# EAGLE design EFD01 - C. Feeder (EAGLE 7.4.0)
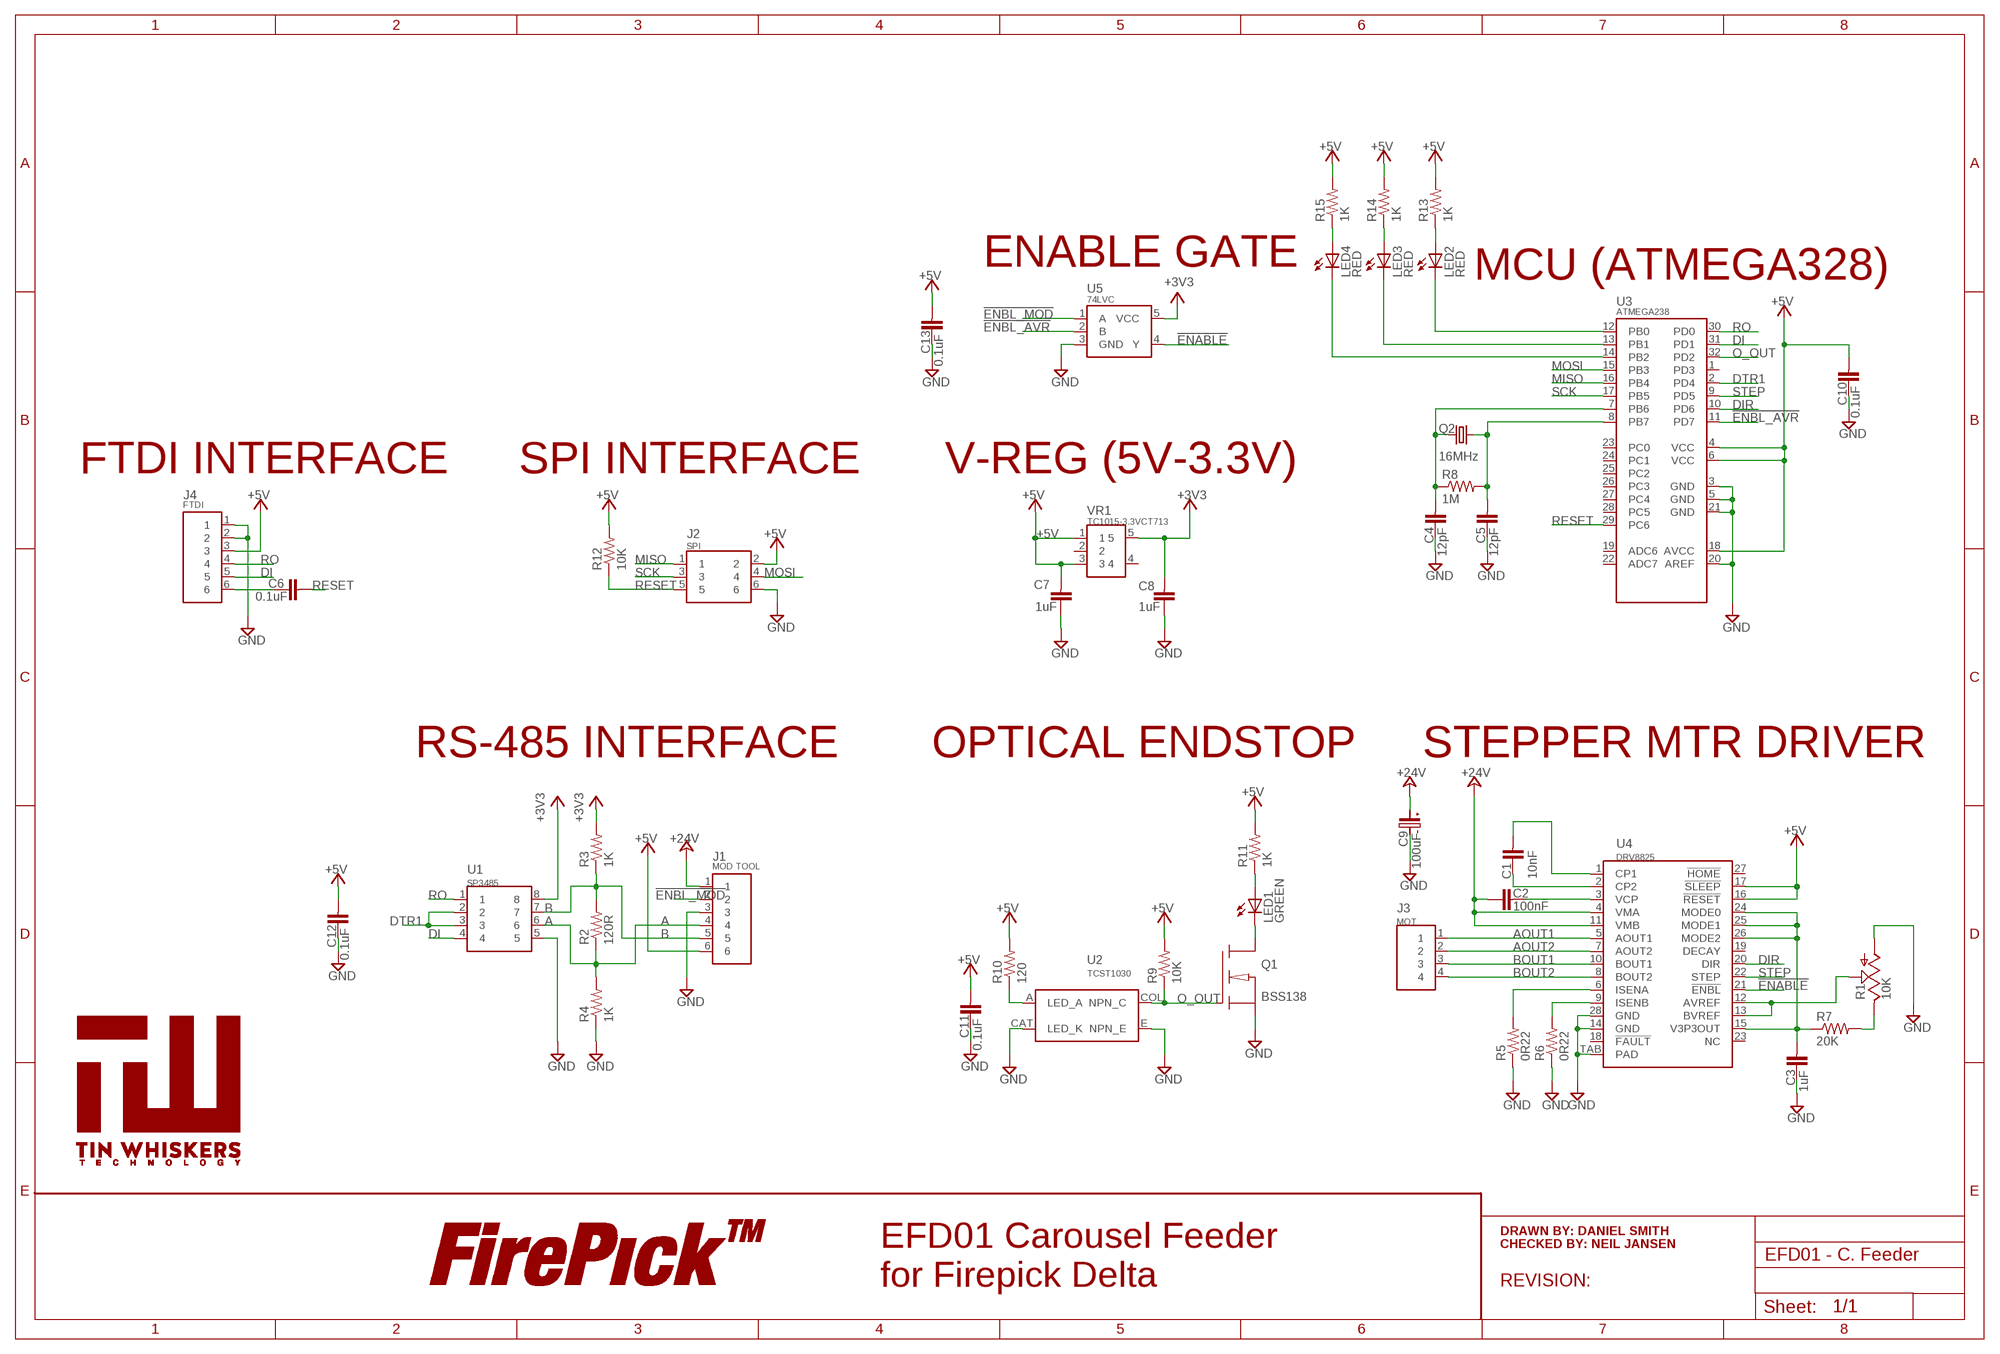
[diagram p0: schematic, sheet 1]

## Parts
C1  10nF  CPL-CAP-X7R-0603-10NF-50V  [C0603]
C2  100nF  CPL-CAP-X7R-0603-100NF-50V  [C0603]
C3  1uF  CPL-CAP-X5R-0603-1UF-50V  [C0603]
C4  12pF  CPL-CAP-C0G-0603-12PF-50V  [C0603]
C5  12pF  CPL-CAP-C0G-0603-12PF-50V  [C0603]
C6  0.1uF  CPL-CAP-X7R-0603-100NF-50V  [C0603]
C7  1uF  CPL-CAP-X5R-0603-1UF-50V  [C0603]
C8  1uF  CPL-CAP-X5R-0603-1UF-50V  [C0603]
C9  100uF  CPL-CAP-ALU-SMD-100UF-50V  [C-SMD-6.3MM]
C10  0.1uF  CPL-CAP-X7R-0603-0.1UF-35V  [C0603]
C11  0.1uF  CPL-CAP-X7R-0603-0.1UF-35V  [C0603]
C12  0.1uF  CPL-CAP-X7R-0603-0.1UF-35V  [C0603]
C13  0.1uF  CPL-CAP-X7R-0603-0.1UF-35V  [C0603]
J1  MOD TOOL  CPL-CON-JST-2.0MM-6P-M-RA  [CONN-JST-PH-2.0MM-6P-SMT-RA]
J2  SPI  CPL-CON-HEADER-0.1IN-2X3P-M  [CON-HDR-2X3P]
J3  MOT  CPL-CON-JST-2.0MM-4P-M-RA  [CONN-JST-PH-2.0MM-4P-SMT-RA]
J4  FTDI  CPL-CON-HEADER-0.1IN-6P-M  [CON-HDR-6POS-MALE]
LED1  GREEN  CPL-LED-0603-GREEN  [LED0603]
LED2  RED  CPL-LED-0603-RED  [LED0603]
LED3  RED  CPL-LED-0603-RED  [LED0603]
LED4  RED  CPL-LED-0603-RED  [LED0603]
LOGO2  LOGO-FIREPICKLARGE  [LOGO-FIREPICK]
Q1  BSS138  CPL-TRN-NFET-SOT23  [SOT-23-3]
Q2  16MHz  CPL-OSC-CRY-16MHZ-18PF  [HC-49/U-S]
R1  10K  TC33X-2  [TC33X-2]
R2  120R  CPL-RES-0603-120-0.1W  [R0603]
R3  1K  CPL-RES-0603-1K-0.1W  [R0603]
R4  1K  CPL-RES-0603-1K-0.1W  [R0603]
R5  0R22  CPL-RES-1206-0.22-0.5W  [R1206]
R6  0R22  CPL-RES-1206-0.22-0.5W  [R1206]
R7  20K  CPL-RES-0603-20K-0.1W  [R0603]
R8  1M  CPL-RES-0603-1M-0.1W  [R0603]
R9  10K  CPL-RES-0603-10K-0.1W  [R0603]
R10  120  CPL-RES-0603-120-0.1W  [R0603]
R11  1K  CPL-RES-0603-1K-0.1W  [R0603]
R12  10K  CPL-RES-0603-10K-0.1W  [R0603]
R13  1K  CPL-RES-0603-1K-0.1W  [R0603]
R14  1K  CPL-RES-0603-1K-0.1W  [R0603]
R15  1K  CPL-RES-0603-1K-0.1W  [R0603]
U1  SP3485  [SOICN-8]
U2  TCST1030  TCSTXX30  [TCST1030]
U3  ATMEGA238  CPL-MCU-ATMEL-AT328-32TQFP  [32-TQF(ATMEGA)]
U4  DRV8825  CPL-MDR-DRV8825  [28-HSSOP]
U5  74LVC  CPL-IC-LOGIC-OR-1CH-74LVC  [SOT-23-5]
U$1  TIN-WHISKERSSMALL  [TIN-WHISKERS-SMALL]
VR1  TC1015-3.3VCT713  CPL-REG-LIN-3.3V-0.1A  [SOT-23-5]

## Nets
!ENABLE: U4.21(!ENBL) U5.4(Y)
!ENBL_AVR: U3.11(PD7) U5.2(B)
!ENBL_MOD: J1.2 U5.1(A)
+3V3: C8.2 R3.2 U1.8 U5.5(VCC) VR1.5
+5V: C7.2 C10.2 C11.2 C12.2 C13.2 J1.6 J2.2 J4.3 R9.2 R10.2 R11.2 R12.2 R13.2 R14.2 R15.2 U3.4(VCC) U3.6(VCC) U3.18(AVCC) U4.16(!RESET) U4.17(!SLEEP) VR1.1 VR1.3
+24V: C2.1 C9.POS J1.1 U4.4(VMA) U4.11(VMB)
A: J1.4 R2.1 R4.2 U1.6
AOUT1: J3.1 U4.5(AOUT1)
AOUT2: J3.2 U4.7(AOUT2)
B: J1.5 R2.2 R3.1 U1.7
BOUT1: J3.3 U4.10(BOUT1)
BOUT2: J3.4 U4.8(BOUT2)
DI: J4.5 U1.4 U3.31(PD1)
DIR: U3.10(PD6) U4.20(DIR)
DTR1: U1.2 U1.3 U3.2(PD4)
GND: C3.1 C4.1 C5.1 C7.1 C8.1 C9.NEG C10.1 C11.1 C12.1 C13.1 J1.3 J2.6 J4.1 J4.2 Q1.2(S) R1.1(A) R4.1 R5.1 R6.1 U1.5 U2.CAT(LED_K) U2.E(NPN_E) U3.3(GND) U3.5(GND) U3.20(AREF) U3.21(GND) U4.14(GND) U4.28(GND) U4.TAB(PAD) U5.3(GND)
MISO: J2.1 U3.16(PB4)
MOSI: J2.4 U3.15(PB3)
N$1: LED1.C Q1.3(D)
N$2: R10.1 U2.A(LED_A)
N$3: LED1.A R11.1
N$5: C1.2 U4.1(CP1)
N$6: C1.1 U4.2(CP2)
N$7: LED2.C U3.12(PB0)
N$8: R5.2 U4.6(ISENA)
N$9: R6.2 U4.9(ISENB)
N$10: LED2.A R13.1
N$11: LED3.C U3.13(PB1)
N$12: LED3.A R14.1
N$13: C3.2 R7.1 U4.15(V3P3OUT) U4.24(MODE0) U4.25(MODE1) U4.26(MODE2)
N$14: R1.3(E) R7.2
N$15: R1.2(S) U4.12(AVREF) U4.13(BVREF)
N$16: C6.1 J4.6
N$17: LED4.C U3.14(PB2)
N$18: LED4.A R15.1
O_OUT: Q1.1(G) R9.1 U2.COL(NPN_C) U3.32(PD2)
RESET: C6.2 J2.5 R12.1 U3.29(PC6)
RO: J4.4 U1.1 U3.30(PD0)
SCK: J2.3 U3.17(PB5)
STEP: U3.9(PD5) U4.22(STEP)
VCP: C2.2 U4.3(VCP)
XTAL1: C4.2 Q2.1 R8.1 U3.7(PB6)
XTAL2: C5.2 Q2.2 R8.2 U3.8(PB7)
Unconnected: U3.1(PD3) U3.19(ADC6) U3.22(ADC7) U3.23(PC0) U3.24(PC1) U3.25(PC2) U3.26(PC3) U3.27(PC4) U3.28(PC5) U4.18(!FAULT) U4.19(DECAY) U4.23(NC) U4.27(!HOME) VR1.2 VR1.4

## Notes on the sheet
- ENABLE GATE | MCU (ATMEGA328)
- FTDI INTERFACE | SPI INTERFACE | V-REG (5V-3.3V)
- SPI
- RS-485 INTERFACE | OPTICAL ENDSTOP | STEPPER MTR DRIVER
- DRAWN BY: DANIEL SMITH
- CHECKED BY: NEIL JANSEN
- EFD01 Carousel Feeder
  for Firepick Delta
- REVISION:

## Library data of the parts
C1 = TinWhiskers:CPL-CAP-X7R-0603-10NF-50V: Capacitor: 10nF (0.01uF), X7R, 5%; Package: 0603; Datasheet:; PARTNO: GRM188R71H103KA01D
C2 C6 = TinWhiskers:CPL-CAP-X7R-0603-100NF-50V: Capacitor: 100nF, 50V, 10%; Package: 0603; PARTNO: UMK107B7104KA-T
C3 C7 C8 = TinWhiskers:CPL-CAP-X5R-0603-1UF-50V: Capacitor: 1uF, 50V, 10%; Package: 0603; Datasheet: http://www.mouser.com/ds/2/396/mlcc_all_e-541559.pdf; PARTNO: UMK107AB7105KA-T
C4 C5 = TinWhiskers:CPL-CAP-C0G-0603-12PF-50V: Capacitor: 12pF, 50V, 5%; Package: 0603; Datasheet: http://download.siliconexpert.com/pdfs/2011/4/6/10/1/57/701/samelm_/manual/cl10c120jb8nnnc.pdf; PARTNO: GRM1885C1H120FA01J
C9 = TinWhiskers:CPL-CAP-ALU-SMD-100UF-50V: Capacitor: Al-Electrolytic, 100uF, 20%, 50V, 2000hrs@105C; Package: 6.3MM Diameter (Can); Datasheet: http://industrial.panasonic.com/lecs/www-data/pdf/ABA0000/ABA0000CE135.pdf; PARTNO: EMVA500ADA101MHA0G
C10-C13 = TinWhiskers:CPL-CAP-X7R-0603-0.1UF-35V: Capacitor: 0.1uF, 35V, 10%, X7R; Package: 0603; Datasheet: http://www.yuden.co.jp/productdata/catalog/en/mlcc01_hq_e.pdf; PARTNO: UMK107B7104KA-T
J1 = TinWhiskers:CPL-CON-JST-2.0MM-6P-M-RA: Connector: 2.0mm Pitch, 6-POS, Pins, Shrouded; Package: PH-Series (SMT, R/A); Datasheet: http://www.jst-mfg.com/product/pdf/eng/ePH.pdf; PARTNO: S6B-PH-SM4-TB(LF)(SN)
J2 = TinWhiskers:CPL-CON-HEADER-0.1IN-2X3P-M: Connector: 0.1" Pitch, 2x3P Datasheet: http://www.mouser.com/ds/2/418/NG_CD_825440_G_baseFilename-672958.pdf; PARTNO: 67996-206HLF
J3 = TinWhiskers:CPL-CON-JST-2.0MM-4P-M-RA: Connector: 2.0mm Pitch, 4-POS, Pin, Shrouded; Package: PH-Series (SMT, R/A); Datasheet: http://www.jst-mfg.com/product/pdf/eng/ePH.pdf; PARTNO: S4B-PH-SM4-TB(LF)(SN)
J4 = TinWhiskers:CPL-CON-HEADER-0.1IN-6P-M: Connector: Header, 0.1"-Pitch, 6-Pos, Pins (Male); PARTNO: S6B-PH-SM4-TB(LF)(SN)
LED1 = TinWhiskers:CPL-LED-0603-GREEN: LED: Green; Package: 0603; PARTNO: SML-D12M8WT86
LED2-LED4 = TinWhiskers:CPL-LED-0603-RED: LED: Red; Package: 0603; PARTNO: SML-D12M8WT86
LOGO2 = FirePick:LOGO-FIREPICK; BOM: EXCLUDE; DNP: T
Q1 = TinWhiskers:CPL-TRN-NFET-SOT23: MOSFET: N-channel ~200mA; Package: SOT23-3 (SMT); Datasheet: http://www.mouser.com/ds/2/149/BSS138-39381.pdf; PARTNO: BSS138
Q2 = TinWhiskers:CPL-OSC-CRY-16MHZ-18PF: Crystal Oscillator: 16MHz, 18pF, 50 Ohm (ESR); Package: HC-49/US; Datasheet: http://cfm.citizen.co.jp/english/product/pdf/HCM49.pdf; PARTNO: HCM4916000000ABJT
R1 = TinWhiskers:TC33X-2: Potentiometer, Trim: 10 kOhm, 25%; Package: SMT (3-Pin); Datasheet: http://www.mouser.com/ds/2/54/TC33-75480.pdf; PARTNO: TC33X-2-103E
R2 R10 = TinWhiskers:CPL-RES-0603-120-0.1W: Resistor: 120 Ohm, 0.1W, 1%; Package: 0603 (SMT); Datasheet:; PARTNO: RC0603FR-07120RL
R3 R4 R11 R13-R15 = TinWhiskers:CPL-RES-0603-1K-0.1W: Resistor: 1 kOhm, 0.1W, 1%; Package: 0603; Datasheet: http://www.yageo.com/NewPortal/yageodocoutput?fileName=/pdf/R-Chip/PYu-RC_Group_51_RoHS_L_3.pdf; PARTNO: RC0603FR-071KL
R5 R6 = TinWhiskers:CPL-RES-1206-0.22-0.5W: Resistor: 0.22 Ohm, 0.5W, 1%, 100 ppm/C Package: 1206 Datasheet: http://www.mouser.com/ds/2/427/rcwe-244377.pdf; PARTNO: RL1206FR-7W0R22L
R7 = TinWhiskers:CPL-RES-0603-20K-0.1W: Resistor: 20 kOhms, 0.1W, 5%, X7R; Package: 0603;; PARTNO: RC0603FR-0722KL
R8 = TinWhiskers:CPL-RES-0603-1M-0.1W: Resistor: 1MOhm, 0.1W, 5%; Package: 0603; Datasheet: http://www.samsungsem.com/global/support/library/product-catalog/__icsFiles/afieldfile/2015/01/12/CHIP_RESISTOR_150112_1.pdf; PARTNO: RC0603FR-071ML
R9 R12 = TinWhiskers:CPL-RES-0603-10K-0.1W: Resistor: 10kOhm, 0.1W, 1%; Package: 0603; Datasheet: http://www.mouser.com/ds/2/315/AOA0000CE2-37512.pdf; PARTNO: RC0603FR-0710KL
U1 = TinWhiskers:SP3485: Transceiver: RS-485 Chip; Package: SOICN-8; Datasheet: http://www.exar.com/common/content/document.ashx?id=639; PARTNO: SP3485
U2 = TinWhiskers:TCSTXX30: Optical Sensor: Transmissive; Package: Thru-Hole(4-Lead); Datasheet: http://www.farnell.com/datasheets/1809822.pdf; PARTNO: TCST1030
U3 = TinWhiskers:CPL-MCU-ATMEL-AT328-32TQFP: Processor: Atmega AT328; Package: 32-TQFP; Datasheet: http://www.atmel.com/devices/atmega328.aspx; PARTNO: ATMEGA328-AUR
U4 = TinWhiskers:CPL-MDR-DRV8825: Motor Driver: DRV8825 (Texas Instrument); Package: (SMT) 28-HSSOP; Datasheet: http://www.ti.com/lit/ds/symlink/drv8825.pdf; PARTNO: DRV8825PWPR
U5 = TinWhiskers:CPL-IC-LOGIC-OR-1CH-74LVC: Logic Gate: OR, 1-Channel; Package: SOT23-5; Datasheet: http://www.ti.com/lit/ds/symlink/sn74lvc1g32.pdf; PARTNO: SN74LVC1G32DBVR
U$1 = !tin-whiskers-logo:TIN-WHISKERS; PARTNO: *
VR1 = TinWhiskers:CPL-REG-LIN-3.3V-0.1A: Voltage Regulator: Linear, Vmax=6, Vout=3.3V, Io=0.1mA; Package: SOT-23-5 Datasheet: http://www.mouser.com/ds/2/268/21335b-29125.pdf; PARTNO: TC1015-3.3VCT713

## Board
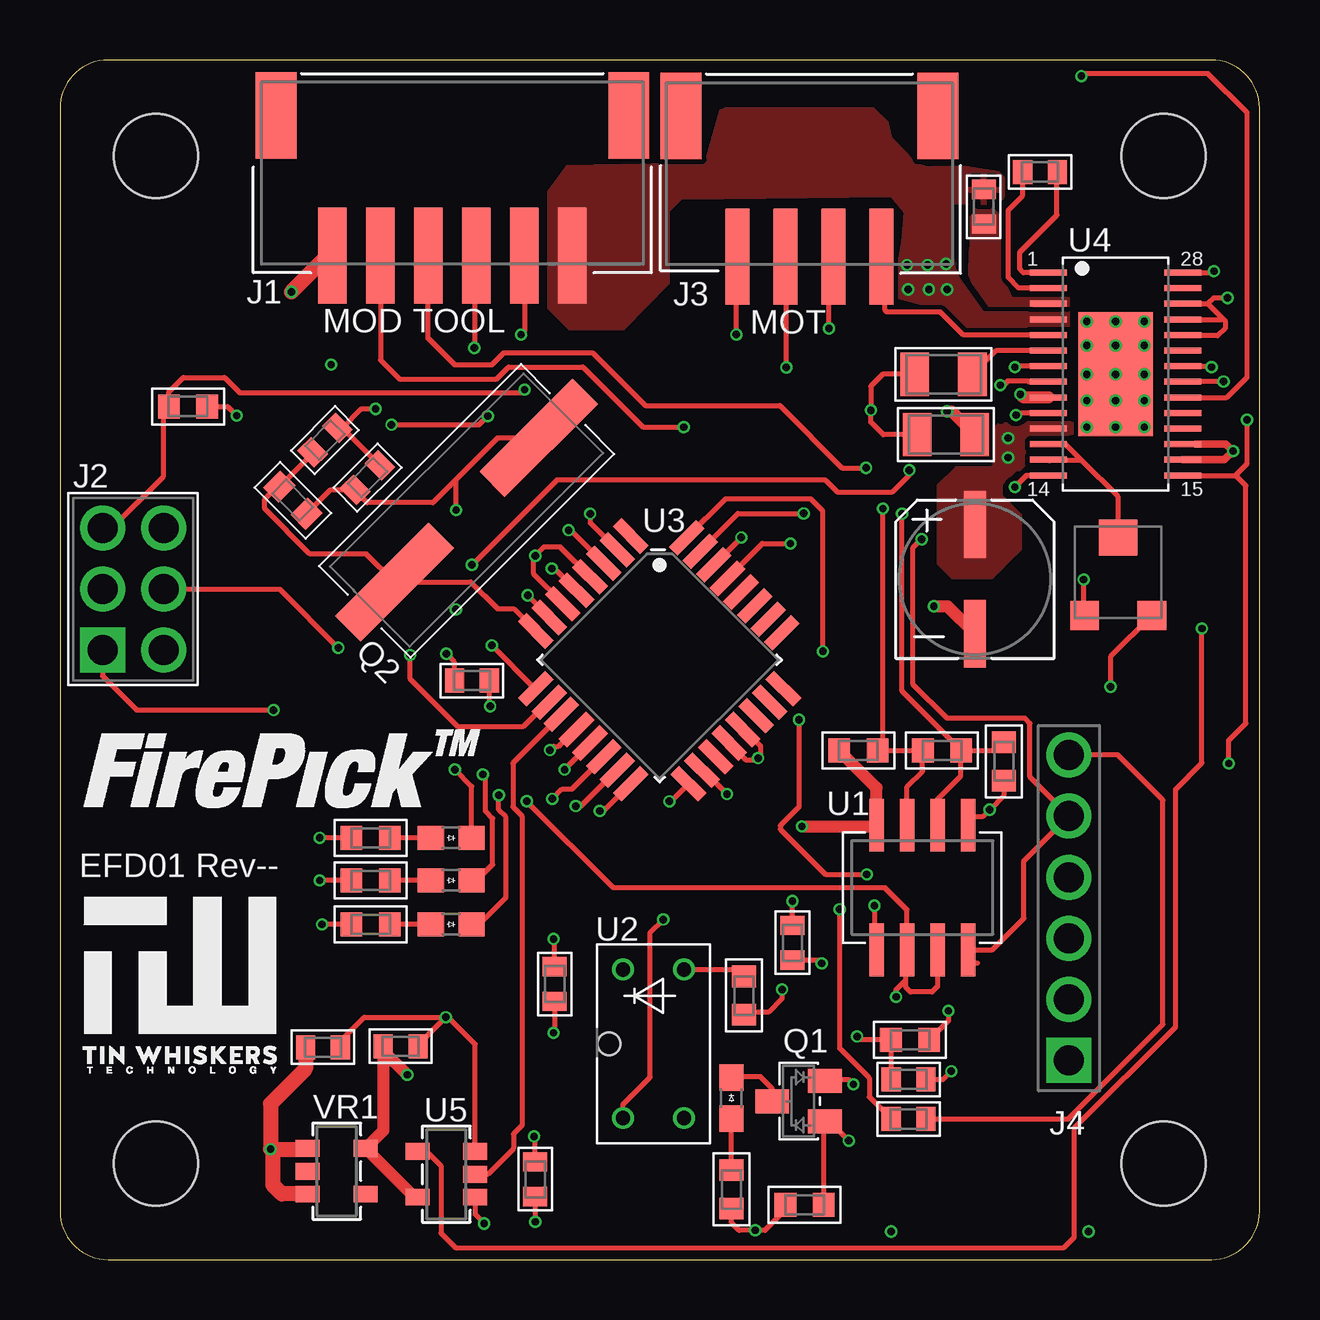
[diagram p1: board, top side]
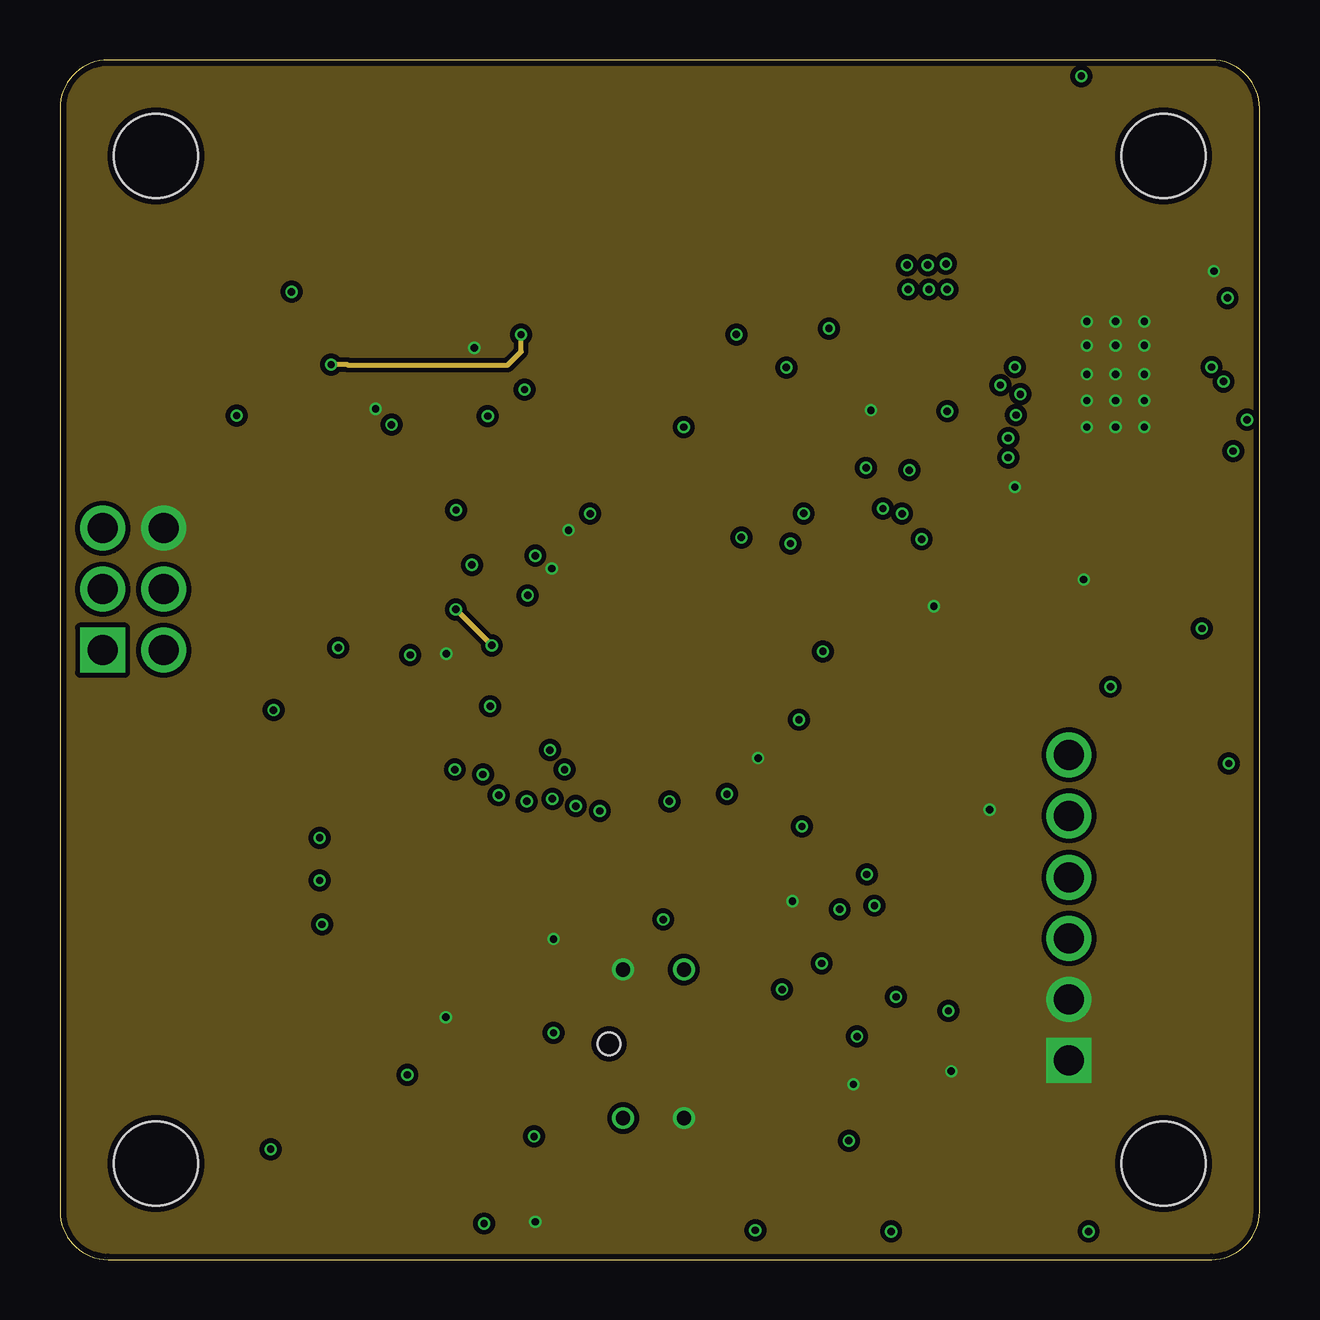
[diagram p2: board, inner layer Route2]
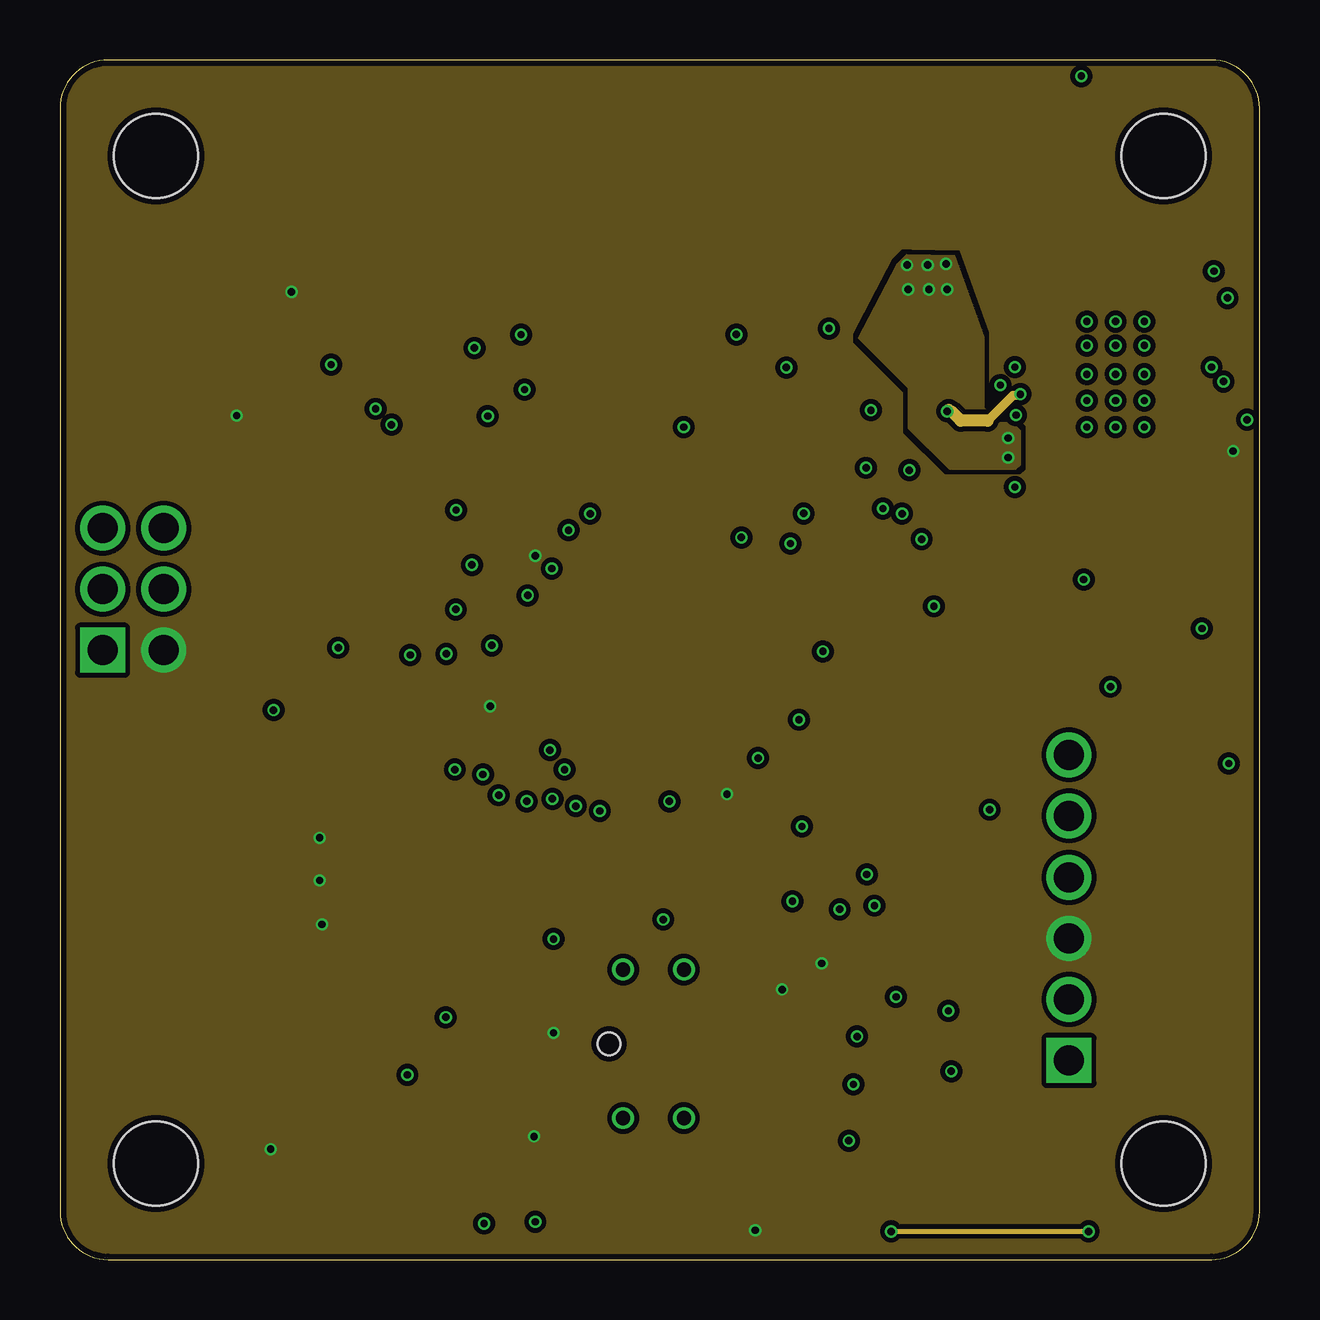
[diagram p3: board, inner layer Route15]
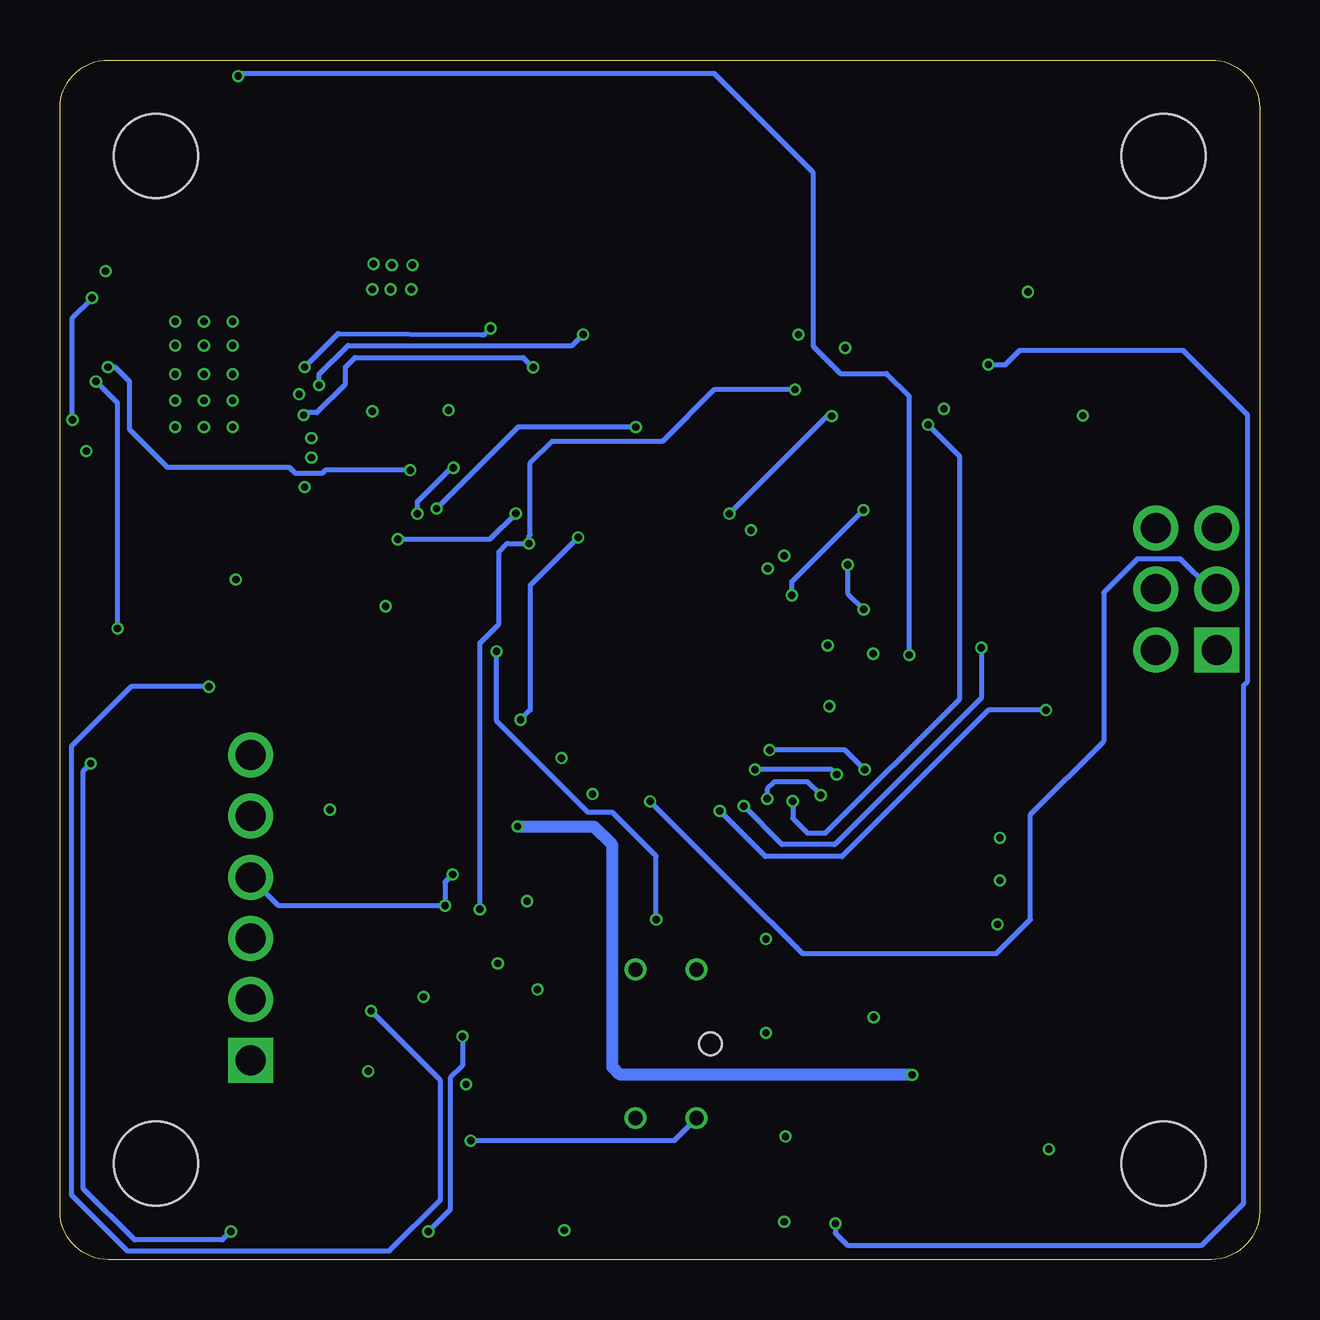
[diagram p4: board, bottom side, seen from below]

Size 50 x 50 mm. Coordinates in mm from the lower left corner, seen from the top.
Outline: 2,0 48,0 arc90 50,2 50,48 arc90 48,50 2,50 arc90 0,48 0,2 arc90 2,0
Copper layers (1*2*15*16): Top 0.035mm / dielectric 0.2mm / Route2 0.0175mm / dielectric 0.3mm / Route15 0.0175mm / dielectric 0.2mm / Bottom 0.035mm
Design rules "HQPCB_4layer_DRU_no_angle": minimum track width 6mil, minimum drill 12mil, track to track 8mil, track to pad 8mil, pad to pad 6mil, via to via 8mil, smd to smd 0mil, copper to edge 10mil, drill to drill 8mil, minimum pad ring 6mil, minimum via ring 4mil, stop-mask expansion 2mil, vias tented up to drill 100mil, thermal gap 10mil
Holes 3.5 mm at 4,4 46,4 46,46 4,46
tKeepout: area 0.8,42.8 to 7.2,49.2; area 42.8,42.8 to 49.2,49.2; area 42.8,0.8 to 49.2,7.2; area 0.8,0.8 to 7.2,7.2
bKeepout: area 0.8,42.8 to 7.2,49.2; area 42.8,42.8 to 49.2,49.2; area 42.8,0.8 to 49.2,7.2; area 0.8,0.8 to 7.2,7.2

### Footprints (pad centres in the part's own frame; a part is rotated, then mirrored left to right if it is on the bottom)
C0603 = smd 0.8 x 1: 1 -0.725,0; 2 0.725,0
C-SMD-6.3MM = smd 0.9 x 2.8: NEG 0,-2.275; POS 0,2.275
CONN-JST-PH-2.0MM-6P-SMT-RA = smd 1.2 x 4: 1 5,0; 2 3,0; 3 1,0; 4 -1,0; 5 -3,0; 6 -5,0 | smd 1.7 x 3.6: NC1 7.35,5.85; NC2 -7.35,5.85
CON-HDR-2X3P = drill 1.25 square: 1 -2.54,1.27 | drill 1.25: 2 -2.54,-1.27; 3 0,1.27; 4 0,-1.27; 5 2.54,1.27; 6 2.54,-1.27
CONN-JST-PH-2.0MM-4P-SMT-RA = smd 1 x 4: 1 3,0; 2 1,0; 3 -1,0; 4 -3,0 | smd 1.7 x 3.6: NC1 5.35,5.85; NC2 -5.35,5.85
CON-HDR-6POS-MALE = drill 1.25 square: 1 -6.35,0 | drill 1.25: 2 -3.8,0; 3 -1.26,0; 4 1.28,0; 5 3.85,0; 6 6.39,0
LED0603 = smd 1.1 x 1: A -0.85,0; C 0.85,0
SOT-23-3 = smd 1 x 1.4: 1 -0.85,-1.1; 2 0.85,-1.1; 3 0,1.1
HC-49/U-S = smd 5.5 x 1.5: 1 -4.25,0; 2 4.25,0
TC33X-2 = smd 1.2 x 1.2: 1 -1.4,-1.8; 3 1.4,-1.8 | smd 1.6 x 1.5: 2 0,1.45
R0603 = smd 0.9 x 1: 1 -0.8,0; 2 0.8,0
R1206 = smd 1.2 x 1.8: 1 -1.2,0; 2 1.2,0
SOICN-8 = smd 2.2 x 0.6: 1 -2.6,1.905; 2 -2.6,0.635; 3 -2.6,-0.635; 4 -2.6,-1.905; 5 2.6,-1.905; 6 2.6,-0.635; 7 2.6,0.635; 8 2.6,1.905
TCST1030 = drill 0.6: A 1.27,3.1; CAT -1.27,3.1; COL -1.27,-3.1; E 1.27,-3.1 | hole 0.95: -1.85,0
32-TQF(ATMEGA) = smd 1.6 x 0.5: 1 -4.5,2.8; 2 -4.5,2; 3 -4.5,1.2; 4 -4.5,0.4; 5 -4.5,-0.4; 6 -4.5,-1.2; 7 -4.5,-2; 8 -4.5,-2.8; 17 4.5,-2.8; 18 4.5,-2; 19 4.5,-1.2; 20 4.5,-0.4; 21 4.5,0.4; 22 4.5,1.2; 23 4.5,2; 24 4.5,2.8 | smd 0.5 x 1.6: 9 -2.8,-4.5; 10 -2,-4.5; 11 -1.3,-4.5; 12 -0.4,-4.5; 13 0.4,-4.5; 14 1.2,-4.5; 15 2,-4.5; 16 2.8,-4.5; 25 2.8,4.4; 26 2,4.4; 27 1.2,4.4; 28 0.4,4.4; 29 -0.4,4.4; 30 -1.2,4.4; 31 -2,4.4; 32 -2.8,4.4
28-HSSOP = smd 1.55 x 0.25: 1 -2.8,4.225; 2 -2.8,3.575; 3 -2.8,2.925; 4 -2.8,2.275; 5 -2.8,1.625; 6 -2.8,0.975; 7 -2.8,0.325; 8 -2.8,-0.325; 9 -2.8,-0.975; 10 -2.8,-1.625; 11 -2.8,-2.275; 12 -2.8,-2.925; 13 -2.8,-3.575; 14 -2.8,-4.225; 15 2.8,-4.225; 16 2.8,-3.575; 17 2.8,-2.925; 18 2.8,-2.275; 19 2.8,-1.625; 20 2.8,-0.975; 21 2.8,-0.325; 22 2.8,0.325; 23 2.8,0.975; 24 2.8,1.625; 25 2.8,2.275; 26 2.8,2.925; 27 2.8,3.575; 28 2.8,4.225 | smd 3.1 x 5.18: TAB 0,0
SOT-23-5 = smd 0.7 x 1: 1 0.95,1.2; 2 0,1.2; 3 -0.95,1.2; 4 -0.95,-1.2; 5 0.95,-1.2

### Placement (x,y rotation side)
C1  40.85,45.33 0 top
C2  38.5,43.88 270 top
C3  35.37,7.51 180 top
C4  12.81,32.6 225 top
C5  11.04,34.15 225 top
C6  35.37,5.86 180 top
C7  10.96,8.85 180 top
C8  14.2,8.89 180 top
C9  38.13,28.36 0 top
C10  17.17,24.13 0 top
C11  20.62,11.48 270 top
C12  30.53,13.21 270 top
C13  19.81,3.35 90 top
J1  16.36,41.84 0 top
J2  3.05,27.94 90 top
J3  31.24,41.81 0 top
J4  42.06,14.65 90 top
LED1  27.99,6.73 90 top
LED2  16.31,17.58 0 top
LED3  16.31,15.8 0 top
LED4  16.31,13.97 0 top
LOGO2  0.79,17.11 0 top
Q1  30.79,6.6 90 top
Q2  16.95,31.24 225 top
R1  44.11,28.65 0 top
R2  36.77,21.22 180 top
R3  33.28,21.22 180 top
R4  39.34,20.76 90 top
R5  36.83,36.9 0 top
R6  36.92,34.38 0 top
R7  35.44,9.16 0 top
R8  9.71,31.65 135 top
R9  31.04,2.29 180 top
R10  28.51,11 270 top
R11  27.99,2.92 270 top
R12  5.33,35.56 0 top
R13  12.95,17.58 180 top
R14  12.95,15.8 180 top
R15  12.95,13.97 180 top
U1  35.95,15.51 90 top
U2  24.74,8.99 0 top
U3  24.99,24.99 315 top
U4  44,36.91 0 top
U5  16.1,3.56 270 top
U$1  0.5,7.5 0 top
VR1  11.53,3.68 90 top

### Tracks (layer width: path | path; a pad name or v marks a point on that pad's centre or on a via)
!ENABLE  (via drill 0.3)
  Top 0.203: U5.4 15.27,4.51 15.88,3.9 15.88,1.1 16.48,0.5 41.85,0.5 42.27,0.91 42.27,5.47 46.5,9.7 46.5,19.6 47.6,20.7 v47.6,26.3 | v48.5,36.6 47.33,36.6 U4.21
  Bottom 0.203: v47.6,26.3 47.6,35.7 v48.5,36.6
!ENBL_AVR
  Top 0.203: U5.2 17.84,3.56 18.9,4.62 18.9,5.23 19.25,5.59 19.25,18.49 18.88,18.86 18.88,20.7 19.1,20.9 20.89,22.69 U3.11
!ENBL_MOD  (via drill 0.3)
  Top 0.203: U5.1 17.3,1.88 v17.68,1.5 | J1.2 19.36,38.69 v19.22,38.55
  Route2 0.203: v19.22,38.55 19.22,37.84 18.66,37.28 11.99,37.28 11.98,37.3 v11.3,37.3
  Bottom 0.203: v17.68,1.5 17.68,1.1 17.18,0.6 2.4,0.6 0.66,2.34 0.66,23.94 0.5,24.1 0.5,35.2 3.2,37.9 10,37.9 10.6,37.3 v11.3,37.3
+3V3  (via drill 0.3)
  Top 0.203: U5.5 14.76,2.61 | C8.2 13.47,8.71 | 33.98,18.05 U1.8
  Top 0.508: C8.2 13.47,5.38 VR1.5 14.76,2.61 | U1.8 34.04,19.66 R3.2 | 13.47,8.71 v14.48,7.7 | v30.93,18.05 33.98,18.05
  Bottom 0.508: v14.48,7.7 26.65,7.7 26.98,8.03 26.98,17.27 27.75,18.05 v30.93,18.05
+5V  (via drill 0.3)
  Top 0.203: R12.2 6.99,35.56 v7.37,35.18 | U3.6 20.96,27.36 19.75,28.57 19.75,29.27 v19.81,29.34 20.18,29.7 20.85,29.7 U3.4 | R10.2 28.61,10.3 29.53,10.3 30.1,10.88 v30.1,11.26 | 10.3,4.6 VR1.1 | 8.88,4.5 v8.78,4.6 | 47.33,34 U4.17 | U3.18 26.8,20.4 v27.8,19.4 | R9.2 30.24,2.07 29.39,1.22 v28.98,1.22 28.31,1.22 27.99,1.53 R11.2 | J1.6 11.15,41.84 | C10.2 17.89,23.1 v17.93,23.06 | C11.2 20.62,9.5 v20.57,9.45 | C12.2 31.61,12.48 v31.75,12.34 | C13.2 19.81,5.08 v19.76,5.13 | R13.2 v10.82,17.58 | R15.2 v10.92,13.97 | R14.2 v10.82,15.8
  Top 0.305: U4.16 48.53,33.33 v48.9,33.7 48.6,34 47.33,34
  Top 0.635: 10.3,4.6 v8.78,4.6 8.78,6.5 10.24,7.96 C7.2 | VR1.3 9.25,2.73 8.88,3.1 8.88,4.5 | 11.15,41.84 v9.65,40.34
  pour Route15 (rank 2, no thermals): 0,0 50,0 50,50 0,50
+24V  (via drill 0.3)
  Top 0.203: 41.19,39.2 U4.4
  other vias: 39.52,34.24 39.52,33.43 36.17,41.45 35.36,40.44 35.31,41.45 36.22,40.44 36.98,40.44 36.93,41.5
  pour Top (no thermals): 34.91,41.5 34.91,40.07 36.3,39.7 36.8,39.7 37.7,38.8 42.1,38.9 42.1,39.5 38.5,39.5 37.51,40.89 37.32,41.35 37.23,41.95 37.23,45.25 35.61,45.7 35.37,46.05 34.67,46.75 34.52,47.4 33.92,48 27.72,48 27.48,47.92 26.87,45.7 21.11,45.6 20.32,44.51 20.32,39.66 21.22,38.76 23.51,38.76 25.4,40.7 25.4,43.7 25.9,44.2 34.63,44.3 35.17,43.65 35.07,42.4
  pour Top (no thermals): 39.12,34.85 40.18,34.8 40.34,34.95 42.11,34.95 42.21,34.9 42.21,34.39 42.06,34.34 40.39,34.29 40.23,34.14 40.23,33.12 39.98,32.87 39.17,32.87 38.96,33.07 38.96,34.7
  pour Route15 (no thermals): 39.12,34.9 39.67,34.9 40.03,34.54 40.03,33.12 39.83,32.92 37.08,32.92 35.36,34.65 35.36,36.32 33.27,38.4 34.9,41.5 35.31,41.91 37.29,41.86 38.51,38.46 38.51,35.51
  pour Top: 36.37,45.57 37.8,45.57 39.12,45.36 39.37,45.11 39.37,44.3 39.07,43.94 37.34,43.99 35.56,43.54 35.61,45.47
  pour Top (no thermals): 36.58,29.01 37.19,28.4 38.86,28.4 40.08,29.62 40.08,31.04 39.27,31.85 39.27,32.31 40.23,33.27 40.23,33.32 40.23,34.44 39.83,34.85 39.37,34.85 38.91,34.39 38.91,33.12 38.81,33.02 37.34,33.02 36.58,32.26
A  (via drill 0.3)
  Top 0.203: U1.6 36.58,19.18 37.55,20.15 37.55,21.2 R2.1 | R2.1 37.57,21.27 | v33.6,33 32.6,33 30,35.6 24.4,35.6 22.2,37.8 18.5,37.8 18,37.3 16.45,37.3 15.34,38.41 15.34,41.82 J1.4 | R2.1 39,21.22 R4.2 | R2.1 35.1,23.69 v35.1,31.09
  Bottom 0.203: v33.6,33 33.7,33 35.1,31.6 v35.1,31.09
AOUT1
  Top 0.203: U4.5 37.67,38.53 36.7,39.5 34.47,39.5 34.39,39.57 34.39,41.66 J3.1
AOUT2  (via drill 0.3)
  Top 0.203: U4.7 39.83,37.23 v39.8,37.2 | v32.05,38.81 32.05,41.62 J3.2
  Bottom 0.203: v39.8,37.2 38.4,38.6 32.42,38.55 32.32,38.55 v32.05,38.81
B  (via drill 0.3)
  Top 0.203: v26,34.7 24.3,34.7 21.8,37.2 18.7,37.2 18.2,36.7 14.15,36.7 13.36,37.49 J1.5 | U1.7 35.31,19.71 35.95,20.35 35.95,21.2 R2.2 R3.1 34.05,21.25 34.3,21.5 v34.3,31.3
  Bottom 0.203: v26,34.7 30.9,34.7 v34.3,31.3
BOUT1  (via drill 0.3)
  Top 0.203: U4.10 39.93,35.28 v39.85,35.2 | v30.28,37.19 30.28,41.78 J3.3
  Bottom 0.203: v39.85,35.2 39.8,35.2 39.7,35.3 39.3,35.3 38.1,36.5 38.1,37.2 37.7,37.6 30.69,37.6 v30.28,37.19
BOUT2  (via drill 0.3)
  Top 0.203: U4.8 40.38,36.58 40.34,36.63 39.52,36.63 39.35,36.45 v39.2,36.45 | v28.19,38.56 28.19,41.76 J3.4
  Bottom 0.203: v39.2,36.45 39.2,36.9 38,38.1 28.65,38.1 v28.19,38.56
DI  (via drill 0.3)
  Top 0.203: v31,31.1 28.25,31.1 26.69,29.54 U3.31 | 38.25,12.35 37.85,12.35 U1.4 38.87,12.91 40.18,14.22 40.18,16.62 J4.5 40.44,20.12 40.44,22.35 40.23,22.55 36.98,22.55 35.56,23.98 35.56,29.67 v35.92,30.02
  Bottom 0.203: v35.92,30.02 32.08,30.02 v31,31.1
DIR  (via drill 0.3)
  Top 0.203: U3.10 20.33,23.23 19.3,22.2 16.6,22.2 14.6,24.2 v14.6,25.2 | U4.20 48.63,35.93 49.48,36.78 49.48,47.8 47.85,49.43 42.67,49.43 v42.57,49.33
  Bottom 0.203: v14.6,25.2 14.6,35.99 15.54,36.93 17.48,36.93 18.6,38.06 18.6,45.3 22.73,49.43 42.47,49.43 v42.57,49.33
DTR1  (via drill 0.3)
  Top 0.203: U1.3 36.58,11.38 36.35,11.15 35.45,11.15 35.25,11.35 35.25,11.65 | 35.25,11.65 35.25,12.85 U1.2 35.31,14.58 34.39,15.49 23.06,15.49 v19.46,19.1 | U3.2 22.1,30.72 v22.1,31.09 | v34.85,10.95 34.85,11.25 35.25,11.65 | v13.82,34.8 17.48,34.8 v17.83,35.15
  Bottom 0.203: v19.46,19.1 19.46,18.39 18.85,17.78 18.09,17.78 12.5,23.37 12.5,33.48 v13.82,34.8 | v17.83,35.15 18.03,35.15 v22.1,31.09
GND  (via drill 0.3)
  Top 0.203: v33.07,7.3 32.88,7.49 31.93,7.49 Q1.2 | U5.3 17.3,8.98 16.18,10.1 v16.08,10.1 | C7.1 11.69,9.11 12.68,10.1 v16.08,10.1 | C8.1 14.92,8.94 v16.08,10.1 | C3.1 36.81,7.51 v37.15,7.85 | v20.5,28.8 20.62,28.8 U3.5 | v21.2,30.4 21.28,30.4 U3.3 | U3.20 28.6,20.82 29.02,20.82 v29.1,20.9 29.2,21 29.2,21.4 28.51,22.09 U3.21 | U4.28 48.03,41.13 v48.1,41.2 | R5.1 34.3,36.9 33.8,36.4 v33.8,35.4 33.8,34.9 34.31,34.38 R6.1 | U4.14 40.28,32.69 v39.8,32.2 | C4.1 11.77,34.66 | 11.77,34.66 C5.1 11.26,34.66 | 11.77,34.66 12.56,35.46 v13.16,35.46 | J1.3 17.36,39.96 17.27,39.88 v17.27,38 | U1.5 37.85,18.47 38.47,18.47 v38.75,18.75 39.34,19.34 R4.1 | R1.1 42.67,26.88 v42.67,28.35 | C10.1 16.45,24.91 v16.1,25.25 | C11.1 20.62,13.31 v20.57,13.36 | C12.1 v30.53,14.94 | C13.1 v19.81,1.57
  Top 0.406: U4.TAB v44,36.9
  Top 0.508: C9.NEG 36.99,27.23 v36.42,27.23
  other vias: 45.2,36.9 45.2,35.8 44,35.8 42.8,35.8 42.8,36.9 42.8,38.1 44,38.1 45.2,38.1 45.2,39.1 44,39.1 42.8,39.1 42.8,34.7 44,34.7 45.2,34.7
  pour Route2 (no thermals): 0,0 50,0 50,50 0,50
MISO  (via drill 0.3)
  Top 0.203: J2.1 1.78,24.32 3.2,22.9 v8.9,22.9 | v22.5,18.7 22.66,18.7 U3.16
  Bottom 0.203: v8.9,22.9 11.3,22.9 17.4,16.8 20.6,16.8 v22.5,18.7
MOSI  (via drill 0.3)
  Top 0.203: J2.4 9.16,27.94 v11.6,25.5 | v21.5,18.9 21.73,18.9 U3.15
  Bottom 0.203: v11.6,25.5 11.6,23.4 17.7,17.3 19.9,17.3 v21.5,18.9
N$1
  Top 0.203: Q1.3 29.69,7.13 29.2,7.62 28.03,7.62 LED1.C
N$2
  Top 0.203: R10.1 | R10.1 28.21,11.8 | U2.A 28.22,12.09 R10.1
N$3
  Top 0.203: R11.1 LED1.A
N$5
  Top 0.203: U4.1 40.17,41.13 40,41.3 40,41.98 41.55,43.54 41.55,45.31 C1.2
N$6
  Top 0.203: U4.2 41.19,40.5 39.97,40.5 39.52,40.95 39.52,43.74 40.13,44.35 40.13,45.32 C1.1
N$7  (via drill 0.3)
  Top 0.203: LED2.C 17.16,19.72 v16.46,20.42 | v20.42,21.23 20.57,21.39 20.78,21.39 21.48,22.09 U3.12
  Bottom 0.203: v16.46,20.42 17.27,21.23 v20.42,21.23
N$8
  Top 0.203: U4.6 39.01,37.88 R5.2
N$9  (via drill 0.3)
  Top 0.508: U4.9 40.16,35.94 v40.03,36.07 | v36.98,35.36 37.15,35.36 R6.2
  Route15 0.381: v40.03,36.07 39.98,36.02 39.73,36.02 38.67,34.96
  Route15 0.508: 37.03,35.41 v36.98,35.36 37.15,35.36 37.55,34.96 38.67,34.96
N$10
  Top 0.203: LED2.A R13.1
N$11  (via drill 0.3)
  Top 0.203: LED3.C 17.37,15.8 18.03,16.46 18.03,18.39 17.73,18.69 17.73,20.12 v17.63,20.22 | v21.03,20.42 22.09,21.48 U3.13
  Bottom 0.203: v17.63,20.22 17.83,20.42 v21.03,20.42
N$12
  Top 0.203: LED3.A R14.1
N$13  (via drill 0.3)
  Top 0.203: C3.2 34.65,9.15 R7.1 33.36,9.16 v33.22,9.3 | U4.26 47.85,39.84 | 47.85,39.84 48.46,39.22 | 48.46,39.22 48.56,39.12 48.56,38.81 48.26,38.51 46.83,38.51 U4.24 | U4.25 48.43,39.19 48.46,39.22 | v49.48,35 49.48,33.17 48.99,32.69 U4.15 46.82,32.66 49.02,32.66 49.43,32.26 49.43,22.35 48.72,21.64 v48.72,20.68 | v48.67,40.08 48.09,40.08 47.85,39.84
  Route15 0.203: v34.65,1.17 v42.88,1.17
  Bottom 0.203: v33.22,9.3 33.22,8.08 33.73,7.57 33.73,2.08 v34.65,1.17 | v49.48,35 49.48,39.27 v48.67,40.08 | v42.88,1.17 43.23,0.81 46.89,0.81 49.02,2.95 49.02,20.37 v48.72,20.68
N$14  (via drill 0.3)
  Top 0.203: v37.03,10.36 37.03,9.95 R7.2 | R1.3 43.79,25.13 v43.79,23.88
  Bottom 0.203: v43.79,23.88 47.04,23.88 49.53,21.39 49.53,2.69 47.19,0.36 36.27,0.36 34.14,2.49 34.14,7.47 v37.03,10.36
N$15
  Top 0.203: 42.6,33.3 41.24,33.3 U4.13 | U4.12 41.92,33.98 42.6,33.3 | R1.2 44.11,31.79 42.6,33.3
N$16
  Top 0.203: C6.1 42.02,5.86 45.97,9.8 45.97,19.15 44.09,21.04 J4.6
N$17  (via drill 0.3)
  Top 0.203: LED4.C 17.48,13.97 18.59,15.09 18.59,18.44 18.29,18.75 v18.29,19.36 | v20.52,19.2 20.93,19.61 21.34,19.61 22.66,20.93 U3.14
  Bottom 0.203: v18.29,19.36 18.85,19.91 20.22,19.91 20.52,19.61 v20.52,19.2
N$18
  Top 0.203: LED4.A R15.1
O_OUT  (via drill 0.3)
  Top 0.203: R9.1 31.84,5.71 Q1.1 32.08,5.75 v32.88,4.95 | U3.32 27.74,31.7 31.3,31.7 31.8,31.2 v31.8,25.35 | U2.COL 23.47,6.47 24.6,7.6 24.6,13.63 v25.15,14.17
  Bottom 0.203: U2.COL 24.41,4.95 v32.88,4.95 | v25.15,14.17 25.15,16.82 26.98,18.64 27.99,18.64 31.8,22.45 v31.8,25.35
RESET  (via drill 0.3)
  Top 0.203: J2.5 2.16,30.48 4.32,32.64 4.32,35.34 R12.1 4.53,36.16 5.14,36.77 6.86,36.77 7.49,36.13 19.24,36.13 v19.37,36.26 | v32.51,14.61 v32.5,14.6 32.5,8.8 33.73,7.57 33.73,6.77 C6.2 | U3.29 29.28,29.84 v30.45,29.84
  Bottom 0.203: v19.37,36.26 22.73,36.26 24.89,34.1 29.5,34.1 30.4,33.2 30.4,30.2 30.45,30.14 30.45,29.85 v30.45,29.84 31.36,29.84 31.7,29.5 31.7,26.5 32.5,25.7 v32.5,14.6
RO  (via drill 0.3)
  Top 0.203: 33.95,12.82 U1.1 33.95,13 v33.95,14.75 | U3.30 v28.4,30.1 | v30.8,22.5 30.8,18.86 30.02,18.09 30.02,17.93 31.9,16.05 v33.63,16.05
  Bottom 0.203: v28.4,30.1 30.4,28.1 30.4,22.9 v30.8,22.5 | J4.4 40.88,14.75 v33.95,14.75 33.95,15.73 v33.63,16.05
SCK  (via drill 0.3)
  Top 0.203: v25.4,19.1 25.46,19.1 U3.17
  Bottom 0.203: J2.3 2.04,27.94 3.3,29.2 5.1,29.2 6.5,27.8 6.5,21.6 9.55,18.55 9.55,14.17 10.97,12.75 19.05,12.75 21.8,15.5 v25.4,19.1
STEP  (via drill 0.3)
  Top 0.203: U3.9 19.81,23.79 v18,25.6 | U4.22 47.97,37.23 v48,37.2 | v35.4,32.9 35.4,32.7 34.7,32 32.4,32 31.9,32.5 20.71,32.5 v17.17,28.96
  Route2 0.203: v18,25.6 v16.5,27.1
  Bottom 0.203: v48,37.2 47.7,37.2 47.1,36.6 47.1,34.6 45.52,33.02 40.44,33.02 40.18,32.77 39.06,32.77 38.93,32.9 v35.4,32.9 | v17.17,28.96 17.17,27.77 v16.5,27.1
VCP
  pour Top (rank 2, no thermals): 37.87,41.04 38.5,39.5 42.1,39.5 42.1,40.1 39.7,40.1 39.32,40.94 39.33,41.09 39.33,42.2 39.33,43.35 38.93,43.8 38.18,43.8 37.94,43.45 37.94,42.25 37.88,42
XTAL1  (via drill 0.3)
  Top 0.203: U3.7 20.4,26.78 v19.49,27.69 | R8.1 11.27,32.08 C4.2 | Q2.1 18.25,34.25 16.46,32.46 | 12.43,31.95 C4.2 | v16.51,31.24 16.51,32.41 16.46,32.46 | 16.46,32.46 15.54,31.55 12.8,31.55 12.3,32.05 C4.2
  Bottom 0.203: v16.51,31.24 19.49,28.26 v19.49,27.69
XTAL2
  Top 0.203: 19.73,26.3 U3.8 18.9,27.13 18.24,27.13 17.12,28.25 Q2.2 12.77,29.41 10.41,29.41 8.53,31.29 8.53,31.7 9.05,32.22 R8.2 10.53,33.6 C5.2

### Text on the board
tPlace: MOD TOOL | MOT | EFD01 Rev--
tNames: U4